# EAGLE design isg-pico-filter-breakout-rev1 (EAGLE 9.2.2)
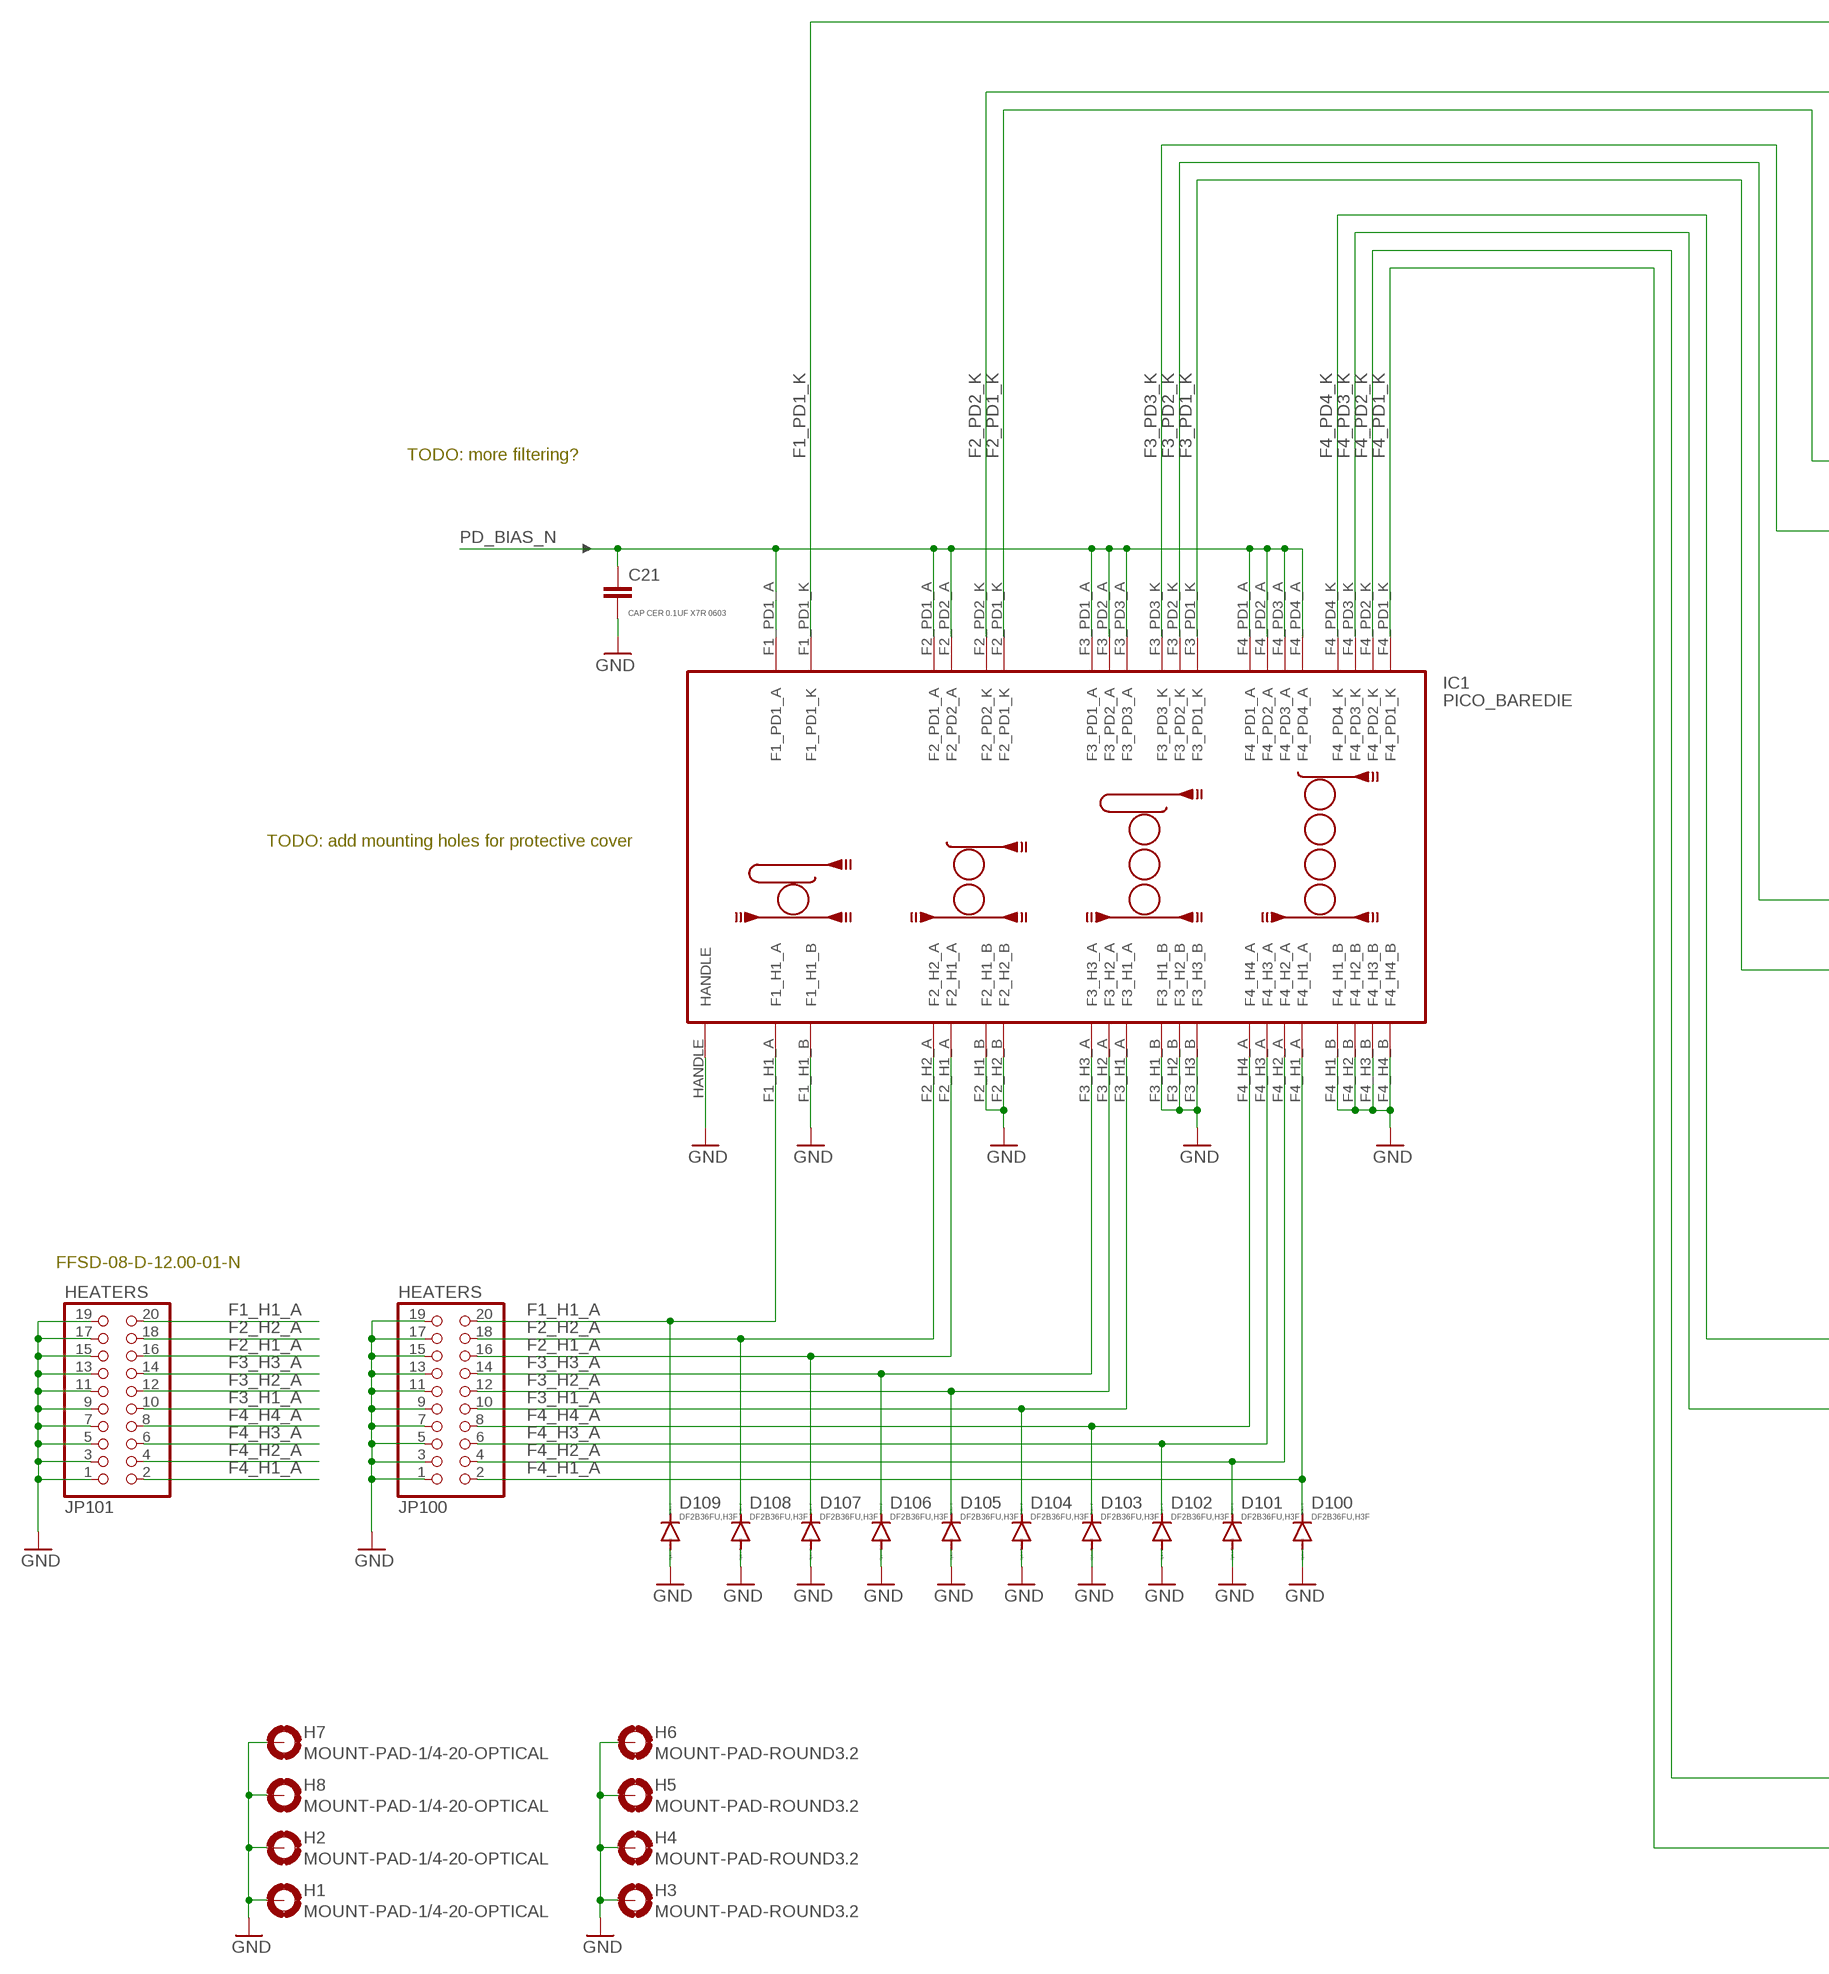
[diagram p0: schematic, sheet 1, part 1 of 2]
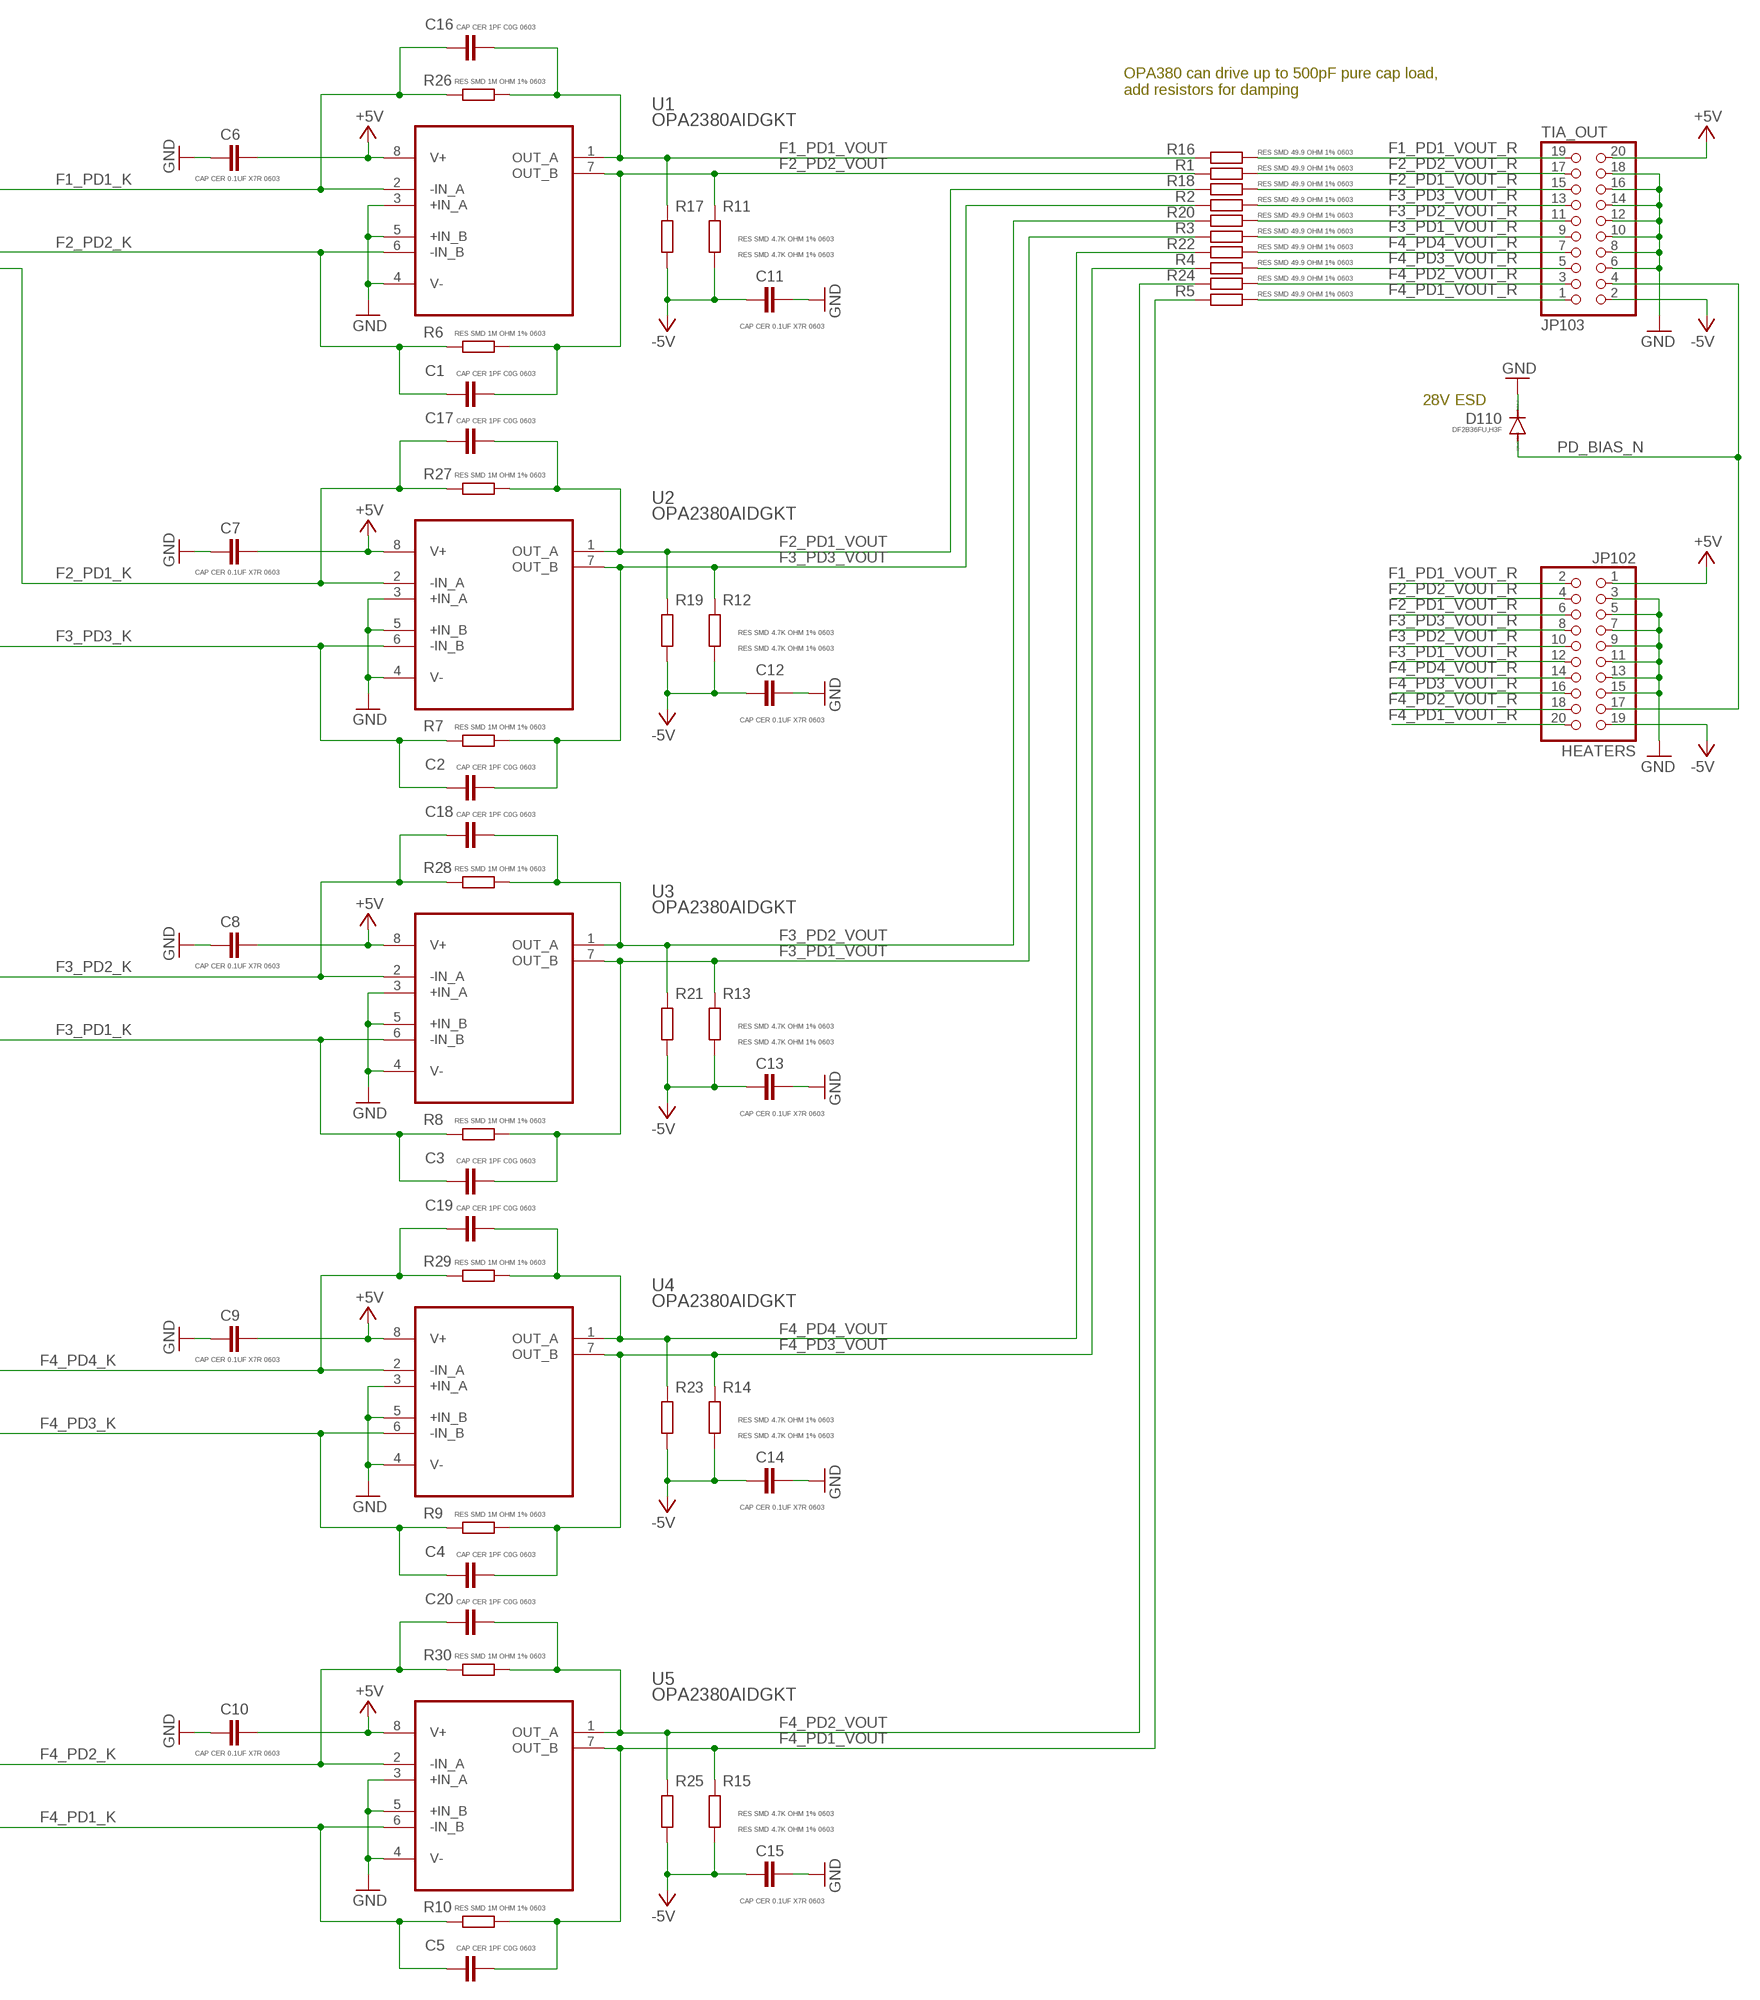
[diagram p1: schematic, sheet 1, part 2 of 2]

## Parts
C1  CAP CER 1PF C0G 0603  C-EUC0603  [C0603]
C2  CAP CER 1PF C0G 0603  C-EUC0603  [C0603]
C3  CAP CER 1PF C0G 0603  C-EUC0603  [C0603]
C4  CAP CER 1PF C0G 0603  C-EUC0603  [C0603]
C5  CAP CER 1PF C0G 0603  C-EUC0603  [C0603]
C6  CAP CER 0.1UF X7R 0603  C-EUC0603  [C0603]
C7  CAP CER 0.1UF X7R 0603  C-EUC0603  [C0603]
C8  CAP CER 0.1UF X7R 0603  C-EUC0603  [C0603]
C9  CAP CER 0.1UF X7R 0603  C-EUC0603  [C0603]
C10  CAP CER 0.1UF X7R 0603  C-EUC0603  [C0603]
C11  CAP CER 0.1UF X7R 0603  C-EUC0603  [C0603]
C12  CAP CER 0.1UF X7R 0603  C-EUC0603  [C0603]
C13  CAP CER 0.1UF X7R 0603  C-EUC0603  [C0603]
C14  CAP CER 0.1UF X7R 0603  C-EUC0603  [C0603]
C15  CAP CER 0.1UF X7R 0603  C-EUC0603  [C0603]
C16  CAP CER 1PF C0G 0603  C-EUC0603  [C0603]
C17  CAP CER 1PF C0G 0603  C-EUC0603  [C0603]
C18  CAP CER 1PF C0G 0603  C-EUC0603  [C0603]
C19  CAP CER 1PF C0G 0603  C-EUC0603  [C0603]
C20  CAP CER 1PF C0G 0603  C-EUC0603  [C0603]
C21  CAP CER 0.1UF X7R 0603  C-EUC0603  [C0603]
D100  DF2B36FU,H3F  DIODE-SOD323-W  [SOD323-W]
D101  DF2B36FU,H3F  DIODE-SOD323-W  [SOD323-W]
D102  DF2B36FU,H3F  DIODE-SOD323-W  [SOD323-W]
D103  DF2B36FU,H3F  DIODE-SOD323-W  [SOD323-W]
D104  DF2B36FU,H3F  DIODE-SOD323-W  [SOD323-W]
D105  DF2B36FU,H3F  DIODE-SOD323-W  [SOD323-W]
D106  DF2B36FU,H3F  DIODE-SOD323-W  [SOD323-W]
D107  DF2B36FU,H3F  DIODE-SOD323-W  [SOD323-W]
D108  DF2B36FU,H3F  DIODE-SOD323-W  [SOD323-W]
D109  DF2B36FU,H3F  DIODE-SOD323-W  [SOD323-W]
D110  DF2B36FU,H3F  DIODE-SOD323-W  [SOD323-W]
H1  MOUNT-PAD-1/4-20-OPTICAL  [MOUNT-PAD-1/4-20]
H2  MOUNT-PAD-1/4-20-OPTICAL  [MOUNT-PAD-1/4-20]
H3  MOUNT-PAD-ROUND3.2  [3,2-PAD]
H4  MOUNT-PAD-ROUND3.2  [3,2-PAD]
H5  MOUNT-PAD-ROUND3.2  [3,2-PAD]
H6  MOUNT-PAD-ROUND3.2  [3,2-PAD]
H7  MOUNT-PAD-1/4-20-OPTICAL  [MOUNT-PAD-1/4-20]
H8  MOUNT-PAD-1/4-20-OPTICAL  [MOUNT-PAD-1/4-20]
IC1  PICO_BAREDIE  DIE-PICO-MULTI-RING-FILTERS  [DIE-PICO-MULTI-RING-FILTERS]
JP100  HEATERS  PINHD-2X10  [2X10]
JP101  HEATERS  FFSD-08-D-12.00-01-N  [FTSH-110-01-L-DV-K-TR]
JP102  HEATERS  FFSD-08-D-12.00-01-N  [FTSH-110-01-L-DV-K-TR]
JP103  TIA_OUT  PINHD-2X10  [2X10]
R1  RES SMD 49.9 OHM 1% 0603  R-EU_R0603  [R0603]
R2  RES SMD 49.9 OHM 1% 0603  R-EU_R0603  [R0603]
R3  RES SMD 49.9 OHM 1% 0603  R-EU_R0603  [R0603]
R4  RES SMD 49.9 OHM 1% 0603  R-EU_R0603  [R0603]
R5  RES SMD 49.9 OHM 1% 0603  R-EU_R0603  [R0603]
R6  RES SMD 1M OHM 1% 0603  R-EU_R0603  [R0603]
R7  RES SMD 1M OHM 1% 0603  R-EU_R0603  [R0603]
R8  RES SMD 1M OHM 1% 0603  R-EU_R0603  [R0603]
R9  RES SMD 1M OHM 1% 0603  R-EU_R0603  [R0603]
R10  RES SMD 1M OHM 1% 0603  R-EU_R0603  [R0603]
R11  RES SMD 4.7K OHM 1% 0603  R-EU_R0603  [R0603]
R12  RES SMD 4.7K OHM 1% 0603  R-EU_R0603  [R0603]
R13  RES SMD 4.7K OHM 1% 0603  R-EU_R0603  [R0603]
R14  RES SMD 4.7K OHM 1% 0603  R-EU_R0603  [R0603]
R15  RES SMD 4.7K OHM 1% 0603  R-EU_R0603  [R0603]
R16  RES SMD 49.9 OHM 1% 0603  R-EU_R0603  [R0603]
R17  RES SMD 4.7K OHM 1% 0603  R-EU_R0603  [R0603]
R18  RES SMD 49.9 OHM 1% 0603  R-EU_R0603  [R0603]
R19  RES SMD 4.7K OHM 1% 0603  R-EU_R0603  [R0603]
R20  RES SMD 49.9 OHM 1% 0603  R-EU_R0603  [R0603]
R21  RES SMD 4.7K OHM 1% 0603  R-EU_R0603  [R0603]
R22  RES SMD 49.9 OHM 1% 0603  R-EU_R0603  [R0603]
R23  RES SMD 4.7K OHM 1% 0603  R-EU_R0603  [R0603]
R24  RES SMD 49.9 OHM 1% 0603  R-EU_R0603  [R0603]
R25  RES SMD 4.7K OHM 1% 0603  R-EU_R0603  [R0603]
R26  RES SMD 1M OHM 1% 0603  R-EU_R0603  [R0603]
R27  RES SMD 1M OHM 1% 0603  R-EU_R0603  [R0603]
R28  RES SMD 1M OHM 1% 0603  R-EU_R0603  [R0603]
R29  RES SMD 1M OHM 1% 0603  R-EU_R0603  [R0603]
R30  RES SMD 1M OHM 1% 0603  R-EU_R0603  [R0603]
U1  OPA2380AIDGKT  [SOP65P490X110-8N]
U2  OPA2380AIDGKT  [SOP65P490X110-8N]
U3  OPA2380AIDGKT  [SOP65P490X110-8N]
U4  OPA2380AIDGKT  [SOP65P490X110-8N]
U5  OPA2380AIDGKT  [SOP65P490X110-8N]

## Nets
+5V: C6.1 C7.1 C8.1 C9.1 C10.1 JP102.1 JP103.20 U1.8(V+) U2.8(V+) U3.8(V+) U4.8(V+) U5.8(V+)
-5V: C11.2 C12.2 C13.2 C14.2 C15.2 JP102.19 JP103.2 R11.2 R12.2 R13.2 R14.2 R15.2 R17.2 R19.2 R21.2 R23.2 R25.2
F1_H1_A: D109.C IC1.F1_H1_A JP100.20 JP101.20
F1_PD1_K: C16.1 IC1.F1_PD1_K R26.1 U1.2(-IN_A)
F1_PD1_VOUT: C16.2 R16.1 R17.1 R26.2 U1.1(OUT_A)
F1_PD1_VOUT_R: JP102.2 JP103.19 R16.2
F2_H1_A: D107.C IC1.F2_H1_A JP100.16 JP101.16
F2_H2_A: D108.C IC1.F2_H2_A JP100.18 JP101.18
F2_PD1_K: C17.1 IC1.F2_PD1_K R27.1 U2.2(-IN_A)
F2_PD1_VOUT: C17.2 R18.1 R19.1 R27.2 U2.1(OUT_A)
F2_PD1_VOUT_R: JP102.6 JP103.15 R18.2
F2_PD2_K: C1.1 IC1.F2_PD2_K R6.1 U1.6(-IN_B)
F2_PD2_VOUT: C1.2 R1.1 R6.2 R11.1 U1.7(OUT_B)
F2_PD2_VOUT_R: JP102.4 JP103.17 R1.2
F3_H1_A: D104.C IC1.F3_H1_A JP100.10 JP101.10
F3_H2_A: D105.C IC1.F3_H2_A JP100.12 JP101.12
F3_H3_A: D106.C IC1.F3_H3_A JP100.14 JP101.14
F3_PD1_K: C3.1 IC1.F3_PD1_K R8.1 U3.6(-IN_B)
F3_PD1_VOUT: C3.2 R3.1 R8.2 R13.1 U3.7(OUT_B)
F3_PD1_VOUT_R: JP102.12 JP103.9 R3.2
F3_PD2_K: C18.1 IC1.F3_PD2_K R28.1 U3.2(-IN_A)
F3_PD2_VOUT: C18.2 R20.1 R21.1 R28.2 U3.1(OUT_A)
F3_PD2_VOUT_R: JP102.10 JP103.11 R20.2
F3_PD3_K: C2.1 IC1.F3_PD3_K R7.1 U2.6(-IN_B)
F3_PD3_VOUT: C2.2 R2.1 R7.2 R12.1 U2.7(OUT_B)
F3_PD3_VOUT_R: JP102.8 JP103.13 R2.2
F4_H1_A: D100.C IC1.F4_H1_A JP100.2 JP101.2
F4_H2_A: D101.C IC1.F4_H2_A JP100.4 JP101.4
F4_H3_A: D102.C IC1.F4_H3_A JP100.6 JP101.6
F4_H4_A: D103.C IC1.F4_H4_A JP100.8 JP101.8
F4_PD1_K: C5.1 IC1.F4_PD1_K R10.1 U5.6(-IN_B)
F4_PD1_VOUT: C5.2 R5.1 R10.2 R15.1 U5.7(OUT_B)
F4_PD1_VOUT_R: JP102.20 JP103.1 R5.2
F4_PD2_K: C20.1 IC1.F4_PD2_K R30.1 U5.2(-IN_A)
F4_PD2_VOUT: C20.2 R24.1 R25.1 R30.2 U5.1(OUT_A)
F4_PD2_VOUT_R: JP102.18 JP103.3 R24.2
F4_PD3_K: C4.1 IC1.F4_PD3_K R9.1 U4.6(-IN_B)
F4_PD3_VOUT: C4.2 R4.1 R9.2 R14.1 U4.7(OUT_B)
F4_PD3_VOUT_R: JP102.16 JP103.5 R4.2
F4_PD4_K: C19.1 IC1.F4_PD4_K R29.1 U4.2(-IN_A)
F4_PD4_VOUT: C19.2 R22.1 R23.1 R29.2 U4.1(OUT_A)
F4_PD4_VOUT_R: JP102.14 JP103.7 R22.2
GND: C6.2 C7.2 C8.2 C9.2 C10.2 C11.1 C12.1 C13.1 C14.1 C15.1 C21.2 D100.A D101.A D102.A D103.A D104.A D105.A D106.A D107.A D108.A D109.A D110.C H1.MOUNT H2.MOUNT H3.B3,2(MOUNT) H4.B3,2(MOUNT) H5.B3,2(MOUNT) H6.B3,2(MOUNT) H7.MOUNT H8.MOUNT IC1.F1_H1_B IC1.F2_H1_B IC1.F2_H2_B IC1.F3_H1_B IC1.F3_H2_B IC1.F3_H3_B IC1.F4_H1_B IC1.F4_H2_B IC1.F4_H3_B IC1.F4_H4_B IC1.HANDLE JP100.1 JP100.3 JP100.5 JP100.7 JP100.9 JP100.11 JP100.13 JP100.15 JP100.17 JP100.19 JP101.1 JP101.3 JP101.5 JP101.7 JP101.9 JP101.11 JP101.13 JP101.15 JP101.17 JP101.19 JP102.3 JP102.5 JP102.7 JP102.9 JP102.11 JP102.13 JP102.15 JP103.6 JP103.8 JP103.10 JP103.12 JP103.14 JP103.16 JP103.18 U1.3(+IN_A) U1.4(V-) U1.5(+IN_B) U2.3(+IN_A) U2.4(V-) U2.5(+IN_B) U3.3(+IN_A) U3.4(V-) U3.5(+IN_B) U4.3(+IN_A) U4.4(V-) U4.5(+IN_B) U5.3(+IN_A) U5.4(V-) U5.5(+IN_B)
PD_BIAS_N: C21.1 D110.A IC1.F1_PD1_A IC1.F2_PD1_A IC1.F2_PD2_A IC1.F3_PD1_A IC1.F3_PD2_A IC1.F3_PD3_A IC1.F4_PD1_A IC1.F4_PD2_A IC1.F4_PD3_A IC1.F4_PD4_A JP102.17 JP103.4

## Notes on the sheet
- OPA380 can drive up to 500pF pure cap load,
  add resistors for damping
- 28V ESD
- TODO: more filtering?
- TODO: add mounting holes for protective cover
- FFSD-08-D-12.00-01-N

## Library data of the parts
C1-C21 = rcl-modified-footprints:C-EU: CAPACITOR, European symbol
D100-D110 = diode:DIODE-: DIODE
H1 H2 H7 H8 = isg-custom:MOUNT-PAD
H3-H6 = holes:MOUNT-PAD-ROUND: MOUNTING PAD, round
IC1 = isg-custom:DIE-PICO-MULTI-RING-FILTERS
JP100 JP103 = pinhead:PINHD-2X10: PIN HEADER
JP101 JP102 = isg-custom:FFSD-08-D-12.00-01-N; VALUE: FFSD-08-D-12.00-01-N
R1-R30 = rcl-modified-footprints:R-EU_: RESISTOR, European symbol
U1-U5 = Texas Instruments_By_element14_Batch_1:OPA2380AIDGKT: 0.05ìV/°C max, SINGLE-SUPPLY CMOS OPERATIONAL AMPLIFIERS Zer.-Drift Series; MPN: OPA2380AIDGKT; OC_FARNELL: -; OC_NEWARK: 10J9510; PACKAGE: MSOP-8; SUPPLIER: Texas Instruments

## Board
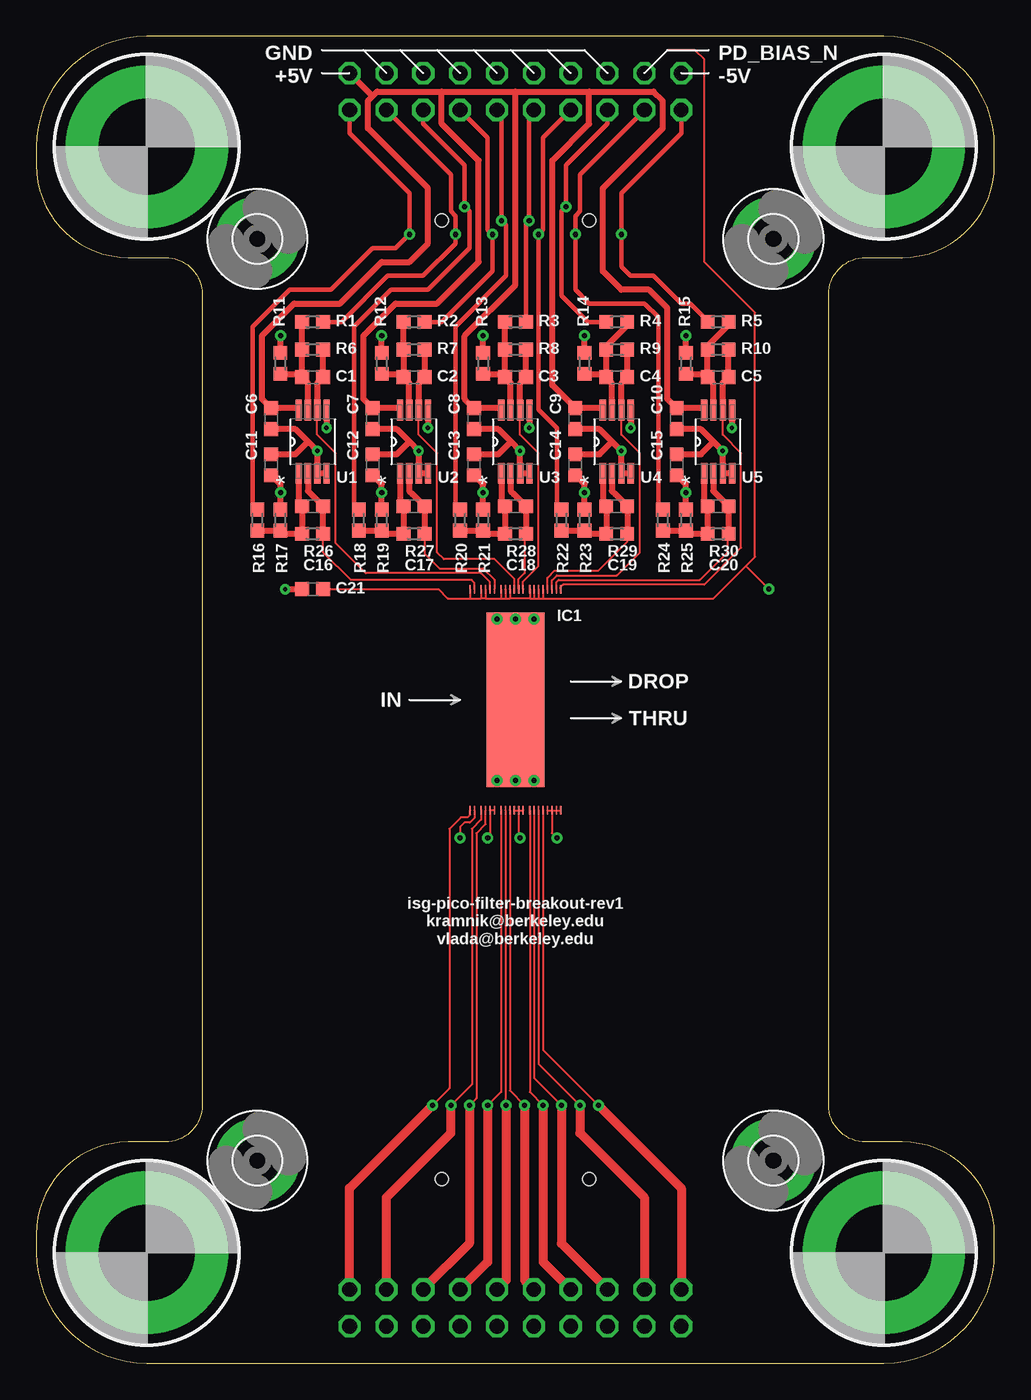
[diagram p2: board, top side]
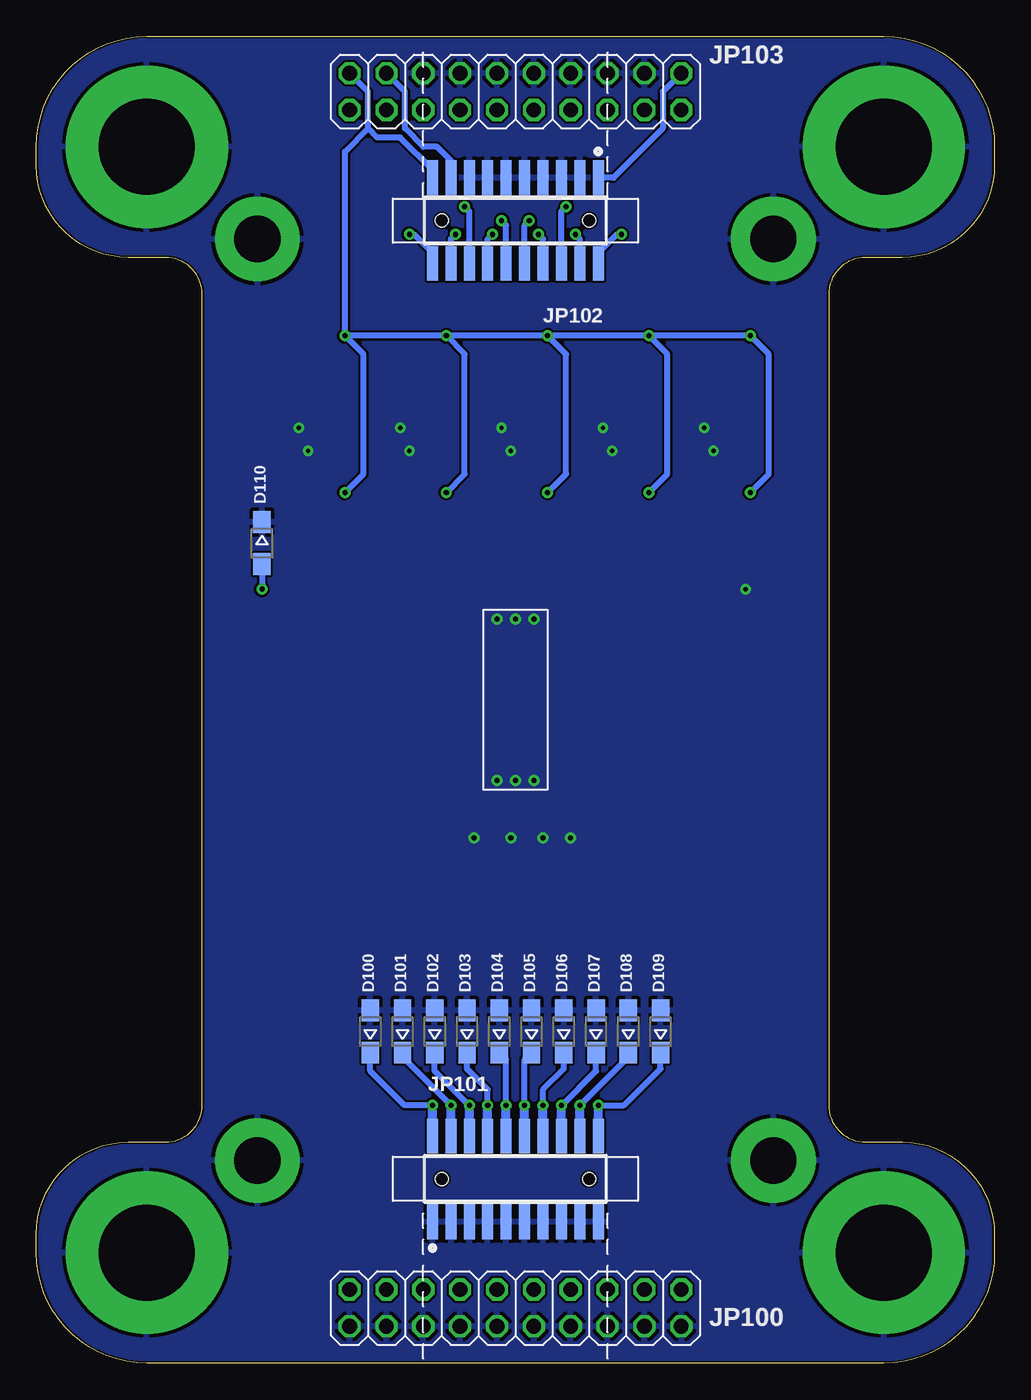
[diagram p3: board, bottom side, seen from below]

Size 66.04 x 91.44 mm. Coordinates in mm from the lower left corner, seen from the top.
Outline: 0,83.82 0,82.55 arc90 6.35,76.2 8.89,76.2 arc-90 11.43,73.66 11.43,17.78 arc-90 8.89,15.24 6.35,15.24 arc90 0,8.89 0,7.62 arc90 7.62,0 58.42,0 arc90 66.04,7.62 66.04,8.89 arc90 59.69,15.24 57.15,15.24 arc-90 54.61,17.78 54.61,73.66 arc-90 57.15,76.2 59.69,76.2 arc90 66.04,82.55 66.04,83.82 arc90 58.42,91.44 7.62,91.44 arc90 0,83.82
Copper layers (1*16): Top 0.035mm / dielectric 1.5mm / Bottom 0.035mm
Design rules "default *": minimum track width 6mil, minimum drill 0.3mm, track to track 6mil, track to pad 6mil, pad to pad 6mil, via to via 6mil, smd to smd 6mil, copper to edge 6mil, drill to drill 6mil, minimum pad ring 10mil, minimum via ring 8mil, stop-mask expansion 4mil, vias tented up to drill 0mil, thermal gap 10mil

### Footprints (pad centres in the part's own frame; a part is rotated, then mirrored left to right if it is on the bottom)
C0603 = smd 0.95 x 0.95: 1 -0.725,0; 2 0.725,0
SOD323-W = smd 1.5 x 1.2: A 1.45,0; C -1.45,0
MOUNT-PAD-1/4-20 = drill 6.604 pad 11.176: MOUNT 0,0
3,2-PAD = drill 3.2 pad 5.842: B3,2 0,0
DIE-PICO-MULTI-RING-FILTERS = smd 0.152 x 0.61: F1_H1_A -3.124,-7.62; F1_H1_B -2.819,-7.62; F1_PD1_A -3.124,7.62; F1_PD1_K -2.819,7.62; F2_H1_A -2.057,-7.62; F2_H1_B -1.753,-7.62; F2_H2_A -2.362,-7.62; F2_H2_B -1.448,-7.62; F2_PD1_A -2.362,7.62; F2_PD1_K -1.448,7.62; F2_PD2_A -2.057,7.62; F2_PD2_K -1.753,7.62; F3_H1_A -0.381,-7.62; F3_H1_B -0.076,-7.62; F3_H2_A -0.686,-7.62; F3_H2_B 0.229,-7.62; F3_H3_A -0.991,-7.62; F3_H3_B 0.533,-7.62; F3_PD1_A -0.991,7.62; F3_PD1_K 0.533,7.62; F3_PD2_A -0.686,7.62; F3_PD2_K 0.229,7.62; F3_PD3_A -0.381,7.62; F3_PD3_K -0.076,7.62; F4_H1_A 1.905,-7.62; F4_H1_B 2.21,-7.62; F4_H2_A 1.6,-7.62; F4_H2_B 2.515,-7.62; F4_H3_A 1.295,-7.62; F4_H3_B 2.819,-7.62; F4_H4_A 0.991,-7.62; F4_H4_B 3.124,-7.62; F4_PD1_A 0.991,7.62; F4_PD1_K 3.124,7.62; F4_PD2_A 1.295,7.62; F4_PD2_K 2.819,7.62; F4_PD3_A 1.6,7.62; F4_PD3_K 2.515,7.62; F4_PD4_A 1.905,7.62; F4_PD4_K 2.21,7.62 | smd 4 x 12: HANDLE 0,0
2X10 = drill 1.016 octagon: 1 -11.43,-1.27; 2 -11.43,1.27; 3 -8.89,-1.27; 4 -8.89,1.27; 5 -6.35,-1.27; 6 -6.35,1.27; 7 -3.81,-1.27; 8 -3.81,1.27; 9 -1.27,-1.27; 10 -1.27,1.27; 11 1.27,-1.27; 12 1.27,1.27; 13 3.81,-1.27; 14 3.81,1.27; 15 6.35,-1.27; 16 6.35,1.27; 17 8.89,-1.27; 18 8.89,1.27; 19 11.43,-1.27; 20 11.43,1.27
FTSH-110-01-L-DV-K-TR = smd 0.76 x 2.4: 1 -5.715,-2.95; 2 -5.715,2.95; 3 -4.445,-2.95; 4 -4.445,2.95; 5 -3.175,-2.95; 6 -3.175,2.95; 7 -1.905,-2.95; 8 -1.905,2.95; 9 -0.635,-2.95; 10 -0.635,2.95; 11 0.635,-2.95; 12 0.635,2.95; 13 1.905,-2.95; 14 1.905,2.95; 15 3.175,-2.95; 16 3.175,2.95; 17 4.445,-2.95; 18 4.445,2.95; 19 5.715,-2.95; 20 5.715,2.95 | hole 0.9: -5.08,0; 5.08,0
R0603 = smd 0.95 x 0.95: 1 -0.725,0; 2 0.725,0
SOP65P490X110-8N = smd 1.422 x 0.432: 1 -2.184,0.965; 2 -2.184,0.33; 3 -2.184,-0.33; 4 -2.184,-0.965; 5 2.184,-0.965; 6 2.184,-0.33; 7 2.184,0.33; 8 2.184,0.965

### Placement (x,y rotation side)
C1  19.05,67.94 180 top
C2  26.04,67.94 180 top
C3  33.02,67.94 180 top
C4  40.01,67.94 180 top
C5  46.99,67.94 180 top
C6  16.19,65.09 270 top
C7  23.18,65.09 270 top
C8  30.16,65.09 270 top
C9  37.15,65.09 270 top
C10  44.13,65.09 270 top
C11  16.19,61.91 270 top
C12  23.18,61.91 270 top
C13  30.16,61.91 270 top
C14  37.15,61.91 270 top
C15  44.13,61.91 270 top
C16  19.05,59.05 180 top
C17  26.04,59.05 180 top
C18  33.02,59.05 180 top
C19  40.01,59.05 180 top
C20  46.99,59.05 180 top
C21  19.05,53.34 180 top
D100  43.02,22.86 90 bottom
D101  40.8,22.86 90 bottom
D102  38.58,22.86 90 bottom
D103  36.35,22.86 90 bottom
D104  34.13,22.86 90 bottom
D105  31.91,22.86 90 bottom
D106  29.69,22.86 90 bottom
D107  27.46,22.86 90 bottom
D108  25.24,22.86 90 bottom
D109  23.02,22.86 90 bottom
D110  50.48,56.52 270 bottom
H1  7.62,83.82 0 top
H2  58.42,83.82 0 top
H3  15.24,77.47 0 top
H4  50.8,77.47 0 top
H5  15.24,13.97 0 top
H6  50.8,13.97 0 top
H7  7.62,7.62 0 top
H8  58.42,7.62 0 top
IC1  33.02,45.72 0 top
JP100  33.02,3.81 0 bottom
JP101  33.02,12.7 0 bottom
JP102  33.02,78.74 180 bottom
JP103  33.02,87.63 0 bottom
R1  19.05,71.75 0 top
R2  26.04,71.75 0 top
R3  33.02,71.75 0 top
R4  40.01,71.75 180 top
R5  46.99,71.75 180 top
R6  19.05,69.85 180 top
R7  26.04,69.85 180 top
R8  33.02,69.85 180 top
R9  40.01,69.85 180 top
R10  46.99,69.85 180 top
R11  16.83,68.9 90 top
R12  23.81,68.9 90 top
R13  30.8,68.9 90 top
R14  37.78,68.9 90 top
R15  44.77,68.9 90 top
R16  15.24,58.1 90 top
R17  16.83,58.1 90 top
R18  22.23,58.1 90 top
R19  23.81,58.1 90 top
R20  29.21,58.1 90 top
R21  30.8,58.1 90 top
R22  36.2,58.1 90 top
R23  37.78,58.1 90 top
R24  43.18,58.1 90 top
R25  44.77,58.1 90 top
R26  19.05,57.15 180 top
R27  26.04,57.15 180 top
R28  33.02,57.15 180 top
R29  40.01,57.15 180 top
R30  46.99,57.15 180 top
U1  19.05,63.5 90 top
U2  26.04,63.5 90 top
U3  33.02,63.5 90 top
U4  40.01,63.5 90 top
U5  46.99,63.5 90 top

### Tracks (layer width: path | path; a pad name or v marks a point on that pad's centre or on a via)
+5V
  Top 0.406: U1.8 17.96,65.81 C6.1 15.56,66.45 15.56,70.8 17.78,73.03 20.95,73.03 23.81,75.88 25.72,75.88 26.99,77.15 26.99,80.96 22.86,85.09 22.86,87 23.18,87.31 | U2.8 24.94,65.81 C7.1 22.54,66.45 22.54,70.8 24.77,73.03 27.62,73.03 30.48,75.88 30.48,82.87 27.94,85.41 27.94,87.63 | U3.8 31.93,65.81 C8.1 29.53,66.45 29.53,70.8 33.02,74.3 33.02,87.63 | U4.8 38.91,65.81 C9.1 35.56,67.4 35.56,82.87 38.1,85.41 38.1,87.63 | U5.8 45.9,65.81 C10.1 43.5,66.45 43.5,72.71 42.23,73.98 40.32,73.98 39.05,75.25 39.05,80.96 43.18,85.09 43.18,87 42.55,87.63 38.1,87.63 | 27.94,87.63 23.5,87.63 23.18,87.31 | 27.94,87.63 33.02,87.63 | 33.02,87.63 38.1,87.63 | JP103.20 23.18,87.31
  Bottom 0.406: JP103.20 22.86,87.63 22.86,85.09 26.26,81.69 JP102.1
-5V  (via drill 0.35)
  Top 0.406: R17.2 v16.83,60.01 16.83,60.55 C11.2 | R19.2 v23.81,60.01 23.81,60.55 C12.2 | R21.2 v30.8,60.01 30.8,60.55 C13.2 | R23.2 v37.78,60.01 37.78,60.55 C14.2 | R25.2 v44.77,60.01 44.77,60.55 C15.2 | R11.2 v16.83,70.8 | R12.2 v23.81,70.8 | R13.2 v30.8,70.8 | R14.2 v37.78,70.8 | R15.2 v44.77,70.8
  Bottom 0.406: v16.83,60.01 15.56,61.28 15.56,69.53 v16.83,70.8 v23.81,70.8 | v23.81,60.01 22.54,61.28 22.54,69.53 v23.81,70.8 | v30.8,60.01 29.53,61.28 29.53,69.53 v30.8,70.8 | v37.78,60.01 36.51,61.28 36.51,69.53 v37.78,70.8 | v44.77,60.01 43.5,61.28 43.5,69.53 v44.77,70.8 | 43.18,85.09 43.18,87.63 JP103.2 | v23.81,70.8 v30.8,70.8 | v30.8,70.8 v37.78,70.8 | v37.78,70.8 v44.77,70.8 | v44.77,70.8 44.77,83.5 43.18,85.09 | JP102.19 38.73,82.23 40.96,84.45 42.55,84.45 43.18,85.09
F1_H1_A  (via drill 0.35)
  Top 0.152: IC1.F1_H1_A 29.9,37.78 29.74,37.62 29.26,37.62 28.47,36.83 28.47,18.94 v27.3,17.78
  Top 0.61: JP100.20 21.59,12.06 v27.3,17.78
  Bottom 0.406: v27.3,17.78 25.54,17.78 23.02,20.3 D109.C
  Bottom 0.61: JP101.20 v27.3,17.78
F1_PD1_K
  Top 0.152: IC1.F1_PD1_K 30.2,53.78 30,53.98 21.68,53.98 19.77,55.88 R26.1
  Top 0.406: U1.2 18.72,60.11 18.94,59.89 18.95,59.89 19.16,59.68 19.16,59.67 C16.1 R26.1
F1_PD1_VOUT
  Top 0.406: U1.1 18.09,59.3 C16.2 R26.2 17.05,57.15 R17.1 R16.1
F1_PD1_VOUT_R  (via drill 0.35)
  Top 0.305: R16.2 14.92,59.15 14.92,71.44 17.46,73.98 20.32,73.98 23.18,76.83 24.77,76.83 v25.72,77.79 25.72,80.64 21.59,84.77 JP103.19
  Bottom 0.406: JP102.2 27.3,76.52 26.04,77.79 v25.72,77.79
F2_H1_A  (via drill 0.35)
  Top 0.152: IC1.F2_H1_A 30.96,37.15 30.33,36.51 30.33,18.26 v29.84,17.78
  Top 0.61: v29.84,17.78 29.84,8.26 JP100.16
  Bottom 0.406: v29.84,17.78 29.82,17.78 27.46,20.14 D107.C
  Bottom 0.61: JP101.16 v29.84,17.78
F2_H2_A  (via drill 0.35)
  Top 0.152: IC1.F2_H2_A 30.66,37.47 30.02,36.83 30.02,19.23 v28.57,17.78
  Top 0.61: JP100.18 24.13,11.43 28.57,15.88 v28.57,17.78
  Bottom 0.406: v28.57,17.78 25.24,21.11 D108.C
  Bottom 0.61: JP101.18 v28.57,17.78
F2_PD1_K
  Top 0.152: IC1.F2_PD1_K 31.57,53.99 30.8,54.77 27.78,54.77 26.76,55.79 R27.1
  Top 0.406: R27.1 C17.1 26.14,59.67 26.14,59.68 25.93,59.89 25.7,60.11 U2.2
F2_PD1_VOUT
  Top 0.406: U2.1 25.07,59.3 C17.2 R27.2 24.04,57.15 R19.1 R18.1
F2_PD1_VOUT_R  (via drill 0.35)
  Top 0.305: R18.2 21.91,59.15 21.91,71.44 24.45,73.98 26.99,73.98 29.84,76.83 29.84,79.38 v29.53,79.69 29.53,82.55 26.67,85.41 JP103.15
  Bottom 0.406: JP102.6 29.84,79.38 v29.53,79.69
F2_PD2_K
  Top 0.152: IC1.F2_PD2_K 31.27,53.82 30.64,54.45 22.7,54.45 20.64,56.52 20.64,62.71 19.37,63.98 19.37,65.67 U1.6
  Top 0.406: U1.6 19.38,67.55 C1.1 R6.1
F2_PD2_VOUT
  Top 0.406: U1.7 18.72,67.55 C1.2 | C1.2 R6.2 R1.1 | R11.1 18.1,68.17 C1.2
F2_PD2_VOUT_R  (via drill 0.35)
  Top 0.305: R1.2 21.05,71.75 24.22,74.93 26.67,74.93 28.89,77.15 v28.89,77.79 28.89,79.06 28.57,79.38 28.57,81.92 JP103.17
  Bottom 0.406: JP102.4 28.57,77.47 v28.89,77.79
F3_H1_A  (via drill 0.35)
  Top 0.152: v33.66,17.78 32.64,18.8 IC1.F3_H1_A
  Top 0.61: v33.66,17.78 33.66,5.71 JP100.10
  Bottom 0.406: v33.66,17.78 33.66,20.93 D104.C
  Bottom 0.61: JP101.10 v33.66,17.78
F3_H2_A  (via drill 0.35)
  Top 0.152: v32.38,17.78 32.33,17.83 IC1.F3_H2_A
  Top 0.61: v32.38,17.78 32.38,5.71 JP100.12
  Bottom 0.406: v32.38,17.78 32.38,20.93 D105.C
  Bottom 0.61: JP101.12 v32.38,17.78
F3_H3_A  (via drill 0.35)
  Top 0.152: v31.11,17.78 32.03,18.69 IC1.F3_H3_A
  Top 0.61: v31.11,17.78 31.11,6.99 JP100.14
  Bottom 0.406: v31.11,17.78 31.11,18.87 29.69,20.3 D106.C
  Bottom 0.61: JP101.14 v31.11,17.78
F3_PD1_K
  Top 0.152: IC1.F3_PD1_K 33.55,53.87 34.61,54.93 34.61,62.71 33.34,63.98 33.34,65.67 U3.6
  Top 0.406: U3.6 33.35,67.55 C3.1 R8.1
F3_PD1_VOUT
  Top 0.406: U3.7 32.69,67.55 C3.2 | C3.2 R8.2 R3.1 | R13.1 32.07,68.17 C3.2
F3_PD1_VOUT_R  (via drill 0.35)
  Top 0.305: R3.2 33.74,78.51 v33.97,78.74 33.97,86.04 JP103.9
  Bottom 0.406: JP102.12 33.66,78.42 v33.97,78.74
F3_PD2_K
  Top 0.152: IC1.F3_PD2_K 33.25,54.05 33.66,54.45 33.66,57.06 R28.1
  Top 0.406: R28.1 C18.1 33.13,59.67 33.13,59.68 32.92,59.89 32.91,59.89 32.69,60.11 U3.2
F3_PD2_VOUT
  Top 0.406: U3.1 32.05,59.3 C18.2 R28.2 31.02,57.15 R21.1 R20.1
F3_PD2_VOUT_R  (via drill 0.35)
  Top 0.305: R20.2 28.89,59.15 28.89,71.44 32.38,74.93 32.38,78.42 v32.07,78.74 32.07,86.04 JP103.11
  Bottom 0.406: JP102.10 32.38,78.42 v32.07,78.74
F3_PD3_K
  Top 0.152: IC1.F3_PD3_K 32.94,54.05 31.59,55.4 28.1,55.4 27.62,55.88 27.62,62.71 26.35,63.98 26.35,65.67 U2.6
  Top 0.406: U2.6 26.36,67.55 C2.1 R7.1
F3_PD3_VOUT
  Top 0.406: U2.7 25.7,67.55 C2.2 | C2.2 R7.2 R2.1 | R12.1 25.08,68.17 C2.2
F3_PD3_VOUT_R  (via drill 0.35)
  Top 0.305: JP103.13 31.11,84.45 31.11,78.11 v31.43,77.79 31.43,75.25 27.94,71.75 R2.2
  Bottom 0.406: JP102.8 31.11,77.47 v31.43,77.79
F4_H1_A  (via drill 0.35)
  Top 0.152: v38.73,17.78 34.92,21.59 IC1.F4_H1_A
  Top 0.61: v38.73,17.78 44.45,12.06 JP100.2
  Bottom 0.406: v38.73,17.78 40.66,17.78 43.02,20.14 D100.C
  Bottom 0.61: JP101.2 v38.73,17.78
F4_H2_A  (via drill 0.35)
  Top 0.152: v37.47,17.78 34.62,20.62 IC1.F4_H2_A
  Top 0.61: v37.47,17.78 37.47,15.88 41.91,11.43 JP100.4
  Bottom 0.406: v37.47,17.78 40.8,21.11 D101.C
  Bottom 0.61: JP101.4 v37.47,17.78
F4_H3_A  (via drill 0.35)
  Top 0.152: v36.2,17.78 34.31,19.66 IC1.F4_H3_A
  Top 0.61: v36.2,17.78 36.2,8.26 JP100.6
  Bottom 0.406: v36.2,17.78 36.22,17.78 38.58,20.14 D102.C
  Bottom 0.61: JP101.6 v36.2,17.78
F4_H4_A  (via drill 0.35)
  Top 0.152: v34.92,17.78 34.01,18.69 IC1.F4_H4_A
  Top 0.61: v34.92,17.78 34.92,6.99 JP100.8
  Bottom 0.406: v34.92,17.78 34.92,18.87 36.35,20.3 D103.C
  Bottom 0.61: JP101.8 v34.92,17.78
F4_PD1_K
  Top 0.152: IC1.F4_PD1_K 36.14,53.5 36.3,53.66 46.04,53.66 48.58,56.2 48.58,62.71 47.31,63.98 47.31,65.67 U5.6
  Top 0.406: R10.1 C5.1 47.32,67.55 U5.6
F4_PD1_VOUT
  Top 0.406: C5.2 R10.2 46.27,70.08 47.72,71.53 R5.1 | U5.7 46.66,67.55 46.31,67.9 C5.2 | R15.1 46.04,68.17 C5.2
F4_PD1_VOUT_R  (via drill 0.35)
  Top 0.305: JP103.1 44.45,84.77 40.32,80.64 v40.32,77.79 40.32,75.56 40.96,74.93 42.55,74.93 44.45,73.03 45.09,73.03 46.27,71.84 R5.2
  Bottom 0.406: JP102.20 38.73,76.52 40.01,77.79 v40.32,77.79
F4_PD2_K
  Top 0.152: IC1.F4_PD2_K 35.84,53.82 35.99,53.98 45.72,53.98 47.62,55.88 47.62,57.06 R30.1
  Top 0.406: R30.1 C20.1 47.1,59.67 47.1,59.68 46.89,59.89 46.88,59.89 46.66,60.11 U5.2
F4_PD2_VOUT
  Top 0.406: U5.1 46.02,59.3 C20.2 R30.2 44.99,57.15 R25.1 R24.1
F4_PD2_VOUT_R  (via drill 0.35)
  Top 0.305: R24.2 42.86,59.15 42.86,72.07 41.91,73.03 38.1,73.03 37.15,73.98 v37.15,77.79 37.15,79.06 37.47,79.38 37.47,81.92 JP103.3
  Bottom 0.406: JP102.18 37.47,77.47 v37.15,77.79
F4_PD3_K
  Top 0.152: IC1.F4_PD3_K 35.53,53.95 35.88,54.29 40.01,54.29 41.59,55.88 41.59,62.71 40.32,63.98 40.32,65.67 U4.6
  Top 0.406: U4.6 40.34,67.55 C4.1 R9.1
F4_PD3_VOUT
  Top 0.406: U4.7 39.67,67.55 C4.2 | C4.2 R9.2 39.28,70.08 40.73,71.53 R4.1 | R14.1 39.05,68.17 C4.2
F4_PD3_VOUT_R  (via drill 0.35)
  Top 0.305: R4.2 38.01,71.75 36.2,73.57 36.2,79.38 v36.51,79.69 36.51,82.55 39.37,85.41 JP103.5
  Bottom 0.406: JP102.16 36.2,79.38 v36.51,79.69
F4_PD4_K
  Top 0.152: IC1.F4_PD4_K 35.23,54.12 35.72,54.61 38.73,54.61 40.73,56.6 R29.1
  Top 0.406: R29.1 C19.1 40.11,59.67 40.11,59.68 39.9,59.89 39.67,60.11 U4.2
F4_PD4_VOUT
  Top 0.406: U4.1 39.04,59.3 C19.2 R29.2 38.01,57.15 R23.1 R22.1
F4_PD4_VOUT_R  (via drill 0.35)
  Top 0.305: JP103.7 34.92,84.45 34.92,78.11 v34.61,77.79 34.61,65.72 35.88,64.45 35.88,59.15 R22.2
  Bottom 0.406: JP102.14 34.92,77.47 v34.61,77.79
GND  (via drill 0.3, 0.35)
  Top 0.152: v29.21,36.2 29.21,36.95 29.51,37.25 29.89,37.25 30.2,37.56 IC1.F1_H1_B | v31.11,36.2 31.27,36.35 IC1.F2_H1_B IC1.F2_H2_B | IC1.F3_H1_B IC1.F3_H2_B | IC1.F3_H2_B IC1.F3_H3_B | IC1.F3_H2_B 33.25,36.28 v33.34,36.2 | IC1.F4_H1_B IC1.F4_H2_B | IC1.F4_H2_B IC1.F4_H3_B IC1.F4_H4_B | IC1.F4_H2_B 35.53,36.54 v35.88,36.2 | IC1.HANDLE v33.02,40.16
  Top 0.406: U2.5 27,64.47 v26.99,64.45 | U5.5 47.95,64.47 v47.94,64.45 | U4.5 40.97,64.47 v40.96,64.45 | U3.5 33.98,64.47 v33.97,64.45 | U1.5 20.02,64.47 v20,64.45 | U5.4 U5.3 47.32,62.85 v47.31,62.87 46.67,63.5 | U4.4 U4.3 40.34,62.85 v40.32,62.87 39.69,63.5 | U3.4 U3.3 33.35,62.85 v33.34,62.87 32.7,63.5 | U2.4 U2.3 26.36,62.85 v26.35,62.87 25.72,63.5 | U1.4 U1.3 19.38,62.85 v19.37,62.87 18.73,63.5 | v17.14,53.34 C21.2 | 18.73,63.5 17.87,64.36 C6.2 | 25.72,63.5 24.86,64.36 C7.2 | 32.7,63.5 31.84,64.36 C8.2 | 39.69,63.5 38.83,64.36 C9.2 | 46.67,63.5 45.81,64.36 C10.2 | C12.1 24.86,62.64 25.72,63.5 | C11.1 17.87,62.64 18.73,63.5 | C13.1 31.84,62.64 32.7,63.5 | C14.1 38.83,62.64 39.69,63.5 | C15.1 45.81,62.64 46.67,63.5
  other vias: 34.29,40.16 31.75,40.16 33.02,51.28 34.29,51.28 31.75,51.28
  pour Bottom: 0,91.44 66.04,91.44 66.04,0 0,0
PD_BIAS_N  (via drill 0.35)
  Top 0.152: C21.1 27.71,53.34 28.35,52.7 29.9,52.7 | 29.9,52.7 30.66,52.7 | 30.96,52.7 32.03,52.7 | 32.03,52.7 32.33,52.7 | 32.33,52.7 32.64,52.7 | 34.01,52.7 34.31,52.7 | 34.31,52.7 34.62,52.7 | 34.62,52.7 34.92,52.7 | IC1.F4_PD1_A 34.01,52.7 | IC1.F4_PD2_A 34.31,52.7 | IC1.F4_PD3_A 34.62,52.7 | IC1.F4_PD4_A 34.92,52.7 | IC1.F3_PD2_A 32.33,52.7 | IC1.F3_PD1_A 32.03,52.7 | IC1.F1_PD1_A 29.9,52.7 | IC1.F2_PD1_A 30.66,52.7 | IC1.F2_PD2_A 30.96,52.7 | 30.96,52.7 30.66,52.7 | IC1.F3_PD3_A 32.64,52.7 | 34.01,52.7 32.64,52.7 | 48.9,54.93 46.67,52.7 34.92,52.7 | 48.9,54.93 49.53,55.56 49.53,72.39 46.04,75.88 46.04,89.85 45.4,90.49 43.5,90.49 JP103.4 | v50.48,53.34 48.9,54.93
  Bottom 0.406: JP102.17 37.47,82.87 38.42,83.82 39.37,83.82 40.64,85.09 40.64,87.63 JP103.4 | D110.A v50.48,53.34

### Text on the board
tPlace: GND | PD_BIAS_N | +5V | -5V | DROP | IN | THRU | isg-pico-filter-breakout-rev1 / kramnik@berkeley.edu / vlada@berkeley.edu